# Altium schematic sheet 08 - RTD.SchDoc
size A4
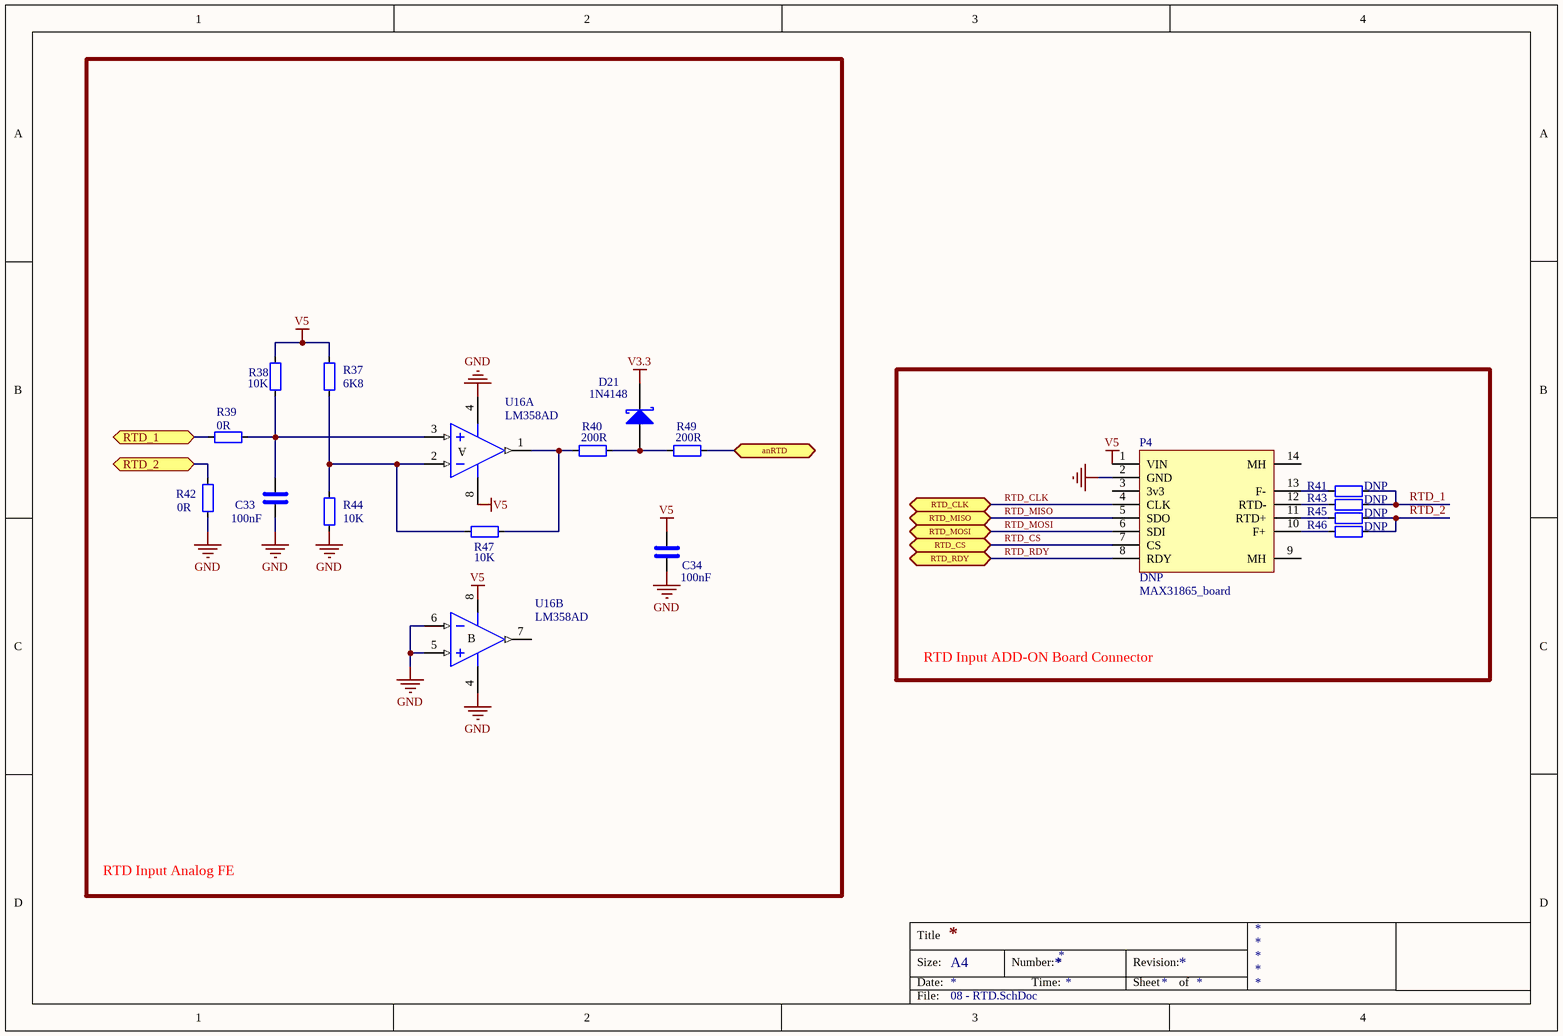
[diagram p0: 08 - RTD.SchDoc]

## Parts
C33  100nF  [CAP_0603]
C34  100nF  [CAP_0603]
D21  1N4148  [SOD323_STM_NW]
P4  DNP  value MAX31865_board  [MAX31865_board]
R37  value 6K8  [RES_0603]  (hidden comment: 60.4Ω)
R38  value 10K  [RES_0603]  (hidden comment: 10K 1%)
R39  0R  [RES_0603]
R40  value 200R  [RES_0603]  (hidden comment: 200R %5)
R41  DNP  [RES_0603]
R42  0R  [RES_0603]
R43  DNP  [RES_0603]
R44  value 10K  [RES_0603]  (hidden comment: 10K 1%)
R45  DNP  [RES_0603]
R46  DNP  [RES_0603]
R47  value 10K  [RES_0603]  (hidden comment: 10K 1%)
R49  value 200R  [RES_0603]  (hidden comment: 200R %5)
U16  LM358AD  [SO8_M]  (parts A,B of 2)

## Blocks framed on the sheet
RTD Input Analog FE: C33 C34 D21 R37-R40 R42 R44 R47 R49 U16
RTD Input ADD-ON Board Connector: P4 R41 R43 R45 R46

## Ports
anRTD (bidir), RTD_1 (bidir), RTD_2 (bidir), RTD_CLK (bidir), RTD_CS (bidir), RTD_MISO (bidir), RTD_MOSI (bidir), RTD_RDY (bidir)

## Nets
GND: C33.2 C34.2 P4.2(GND) R42.2 R44.1 U16.4(V-) U16.5(IN+) U16.6(IN-)
V3.3: D21.1(K)
V5: C34.1 P4.1(VIN) R37.1 R38.2 U16.8(V+)
anRTD: R49.2 ; port anRTD
RTD_1: R41.1 R43.1
RTD_1: R39.1 ; port RTD_1  [a separate net that carries the same name]
RTD_2: R45.1 R46.1
RTD_2: R42.1 ; port RTD_2  [a separate net that carries the same name]
RTD_CLK: P4.4(CLK) ; port RTD_CLK
RTD_CS: P4.7(CS) ; port RTD_CS
RTD_MISO: P4.5(SDO) ; port RTD_MISO
RTD_MOSI: P4.6(SDI) ; port RTD_MOSI
RTD_RDY: P4.8(RDY) ; port RTD_RDY
NetC33_1: C33.1 R38.1 R39.2 U16.3(IN+)
NetD21_2: D21.2(A) R40.2 R49.1
NetP4_10: P4.10(F+) R46.2
NetP4_11: P4.11(RTD+) R45.2
NetP4_12: P4.12(RTD-) R43.2
NetP4_13: P4.13(F-) R41.2
NetR37_2: R37.2 R44.2 R47.2 U16.2(IN-)
NetR40_1: R40.1 R47.1 U16.1(OUT)

Not connected (* = marked no-connect by the designer): P4 3(3v3) 9(MH) 14(MH); U16 7(OUT)

## Notes on the sheet
- Labels drawn without touching a wire or pin: V5
- Title
- Size:
- Date:
- A4
- Number:
- Time:
- Revision:
- Sheet
- of
- File:
- (in symbol LM358AD, part A) A
- (in symbol LM358AD, part B) B

## Library data of the parts
C33 C34 = C: pdf: https://www.lcsc.com/datasheet/lcsc_datasheet_2501031500_HRE-CGA0603X7R104K500JT_C6119867.pdf; LCSC PART: C6119867; lcsc link: https://www.lcsc.com/product-detail/Multilayer-Ceramic-Capacitors-MLCC-SMD-SMT_HRE-CGA0603X7R104K500JT_C6119867.html?s_z=n_100nF; JLCPCB: C6119867; Value: 100nF
D21 = 1N4148_KA: LCSC PART: C84063; JLCPCB: C84063; lcsc link: https://www.lcsc.com/product-detail/Switching-Diodes_Changzhou-Starsea-Elec-1N4148WS_C84063.html?s_z=n_1n4148; pdf: https://www.lcsc.com/datasheet/lcsc_datasheet_1811021610_Changzhou-Starsea-Elec-1N4148WS_C84063.pdf; Value: 1N4148
P4 = MAX31865_board: LatestRevisionDate: 17-Jul-2002; LatestRevisionNote: Re-released for DXP Platform.; Publisher: Altium Limited
R37-R47 R49 = R
  R38 R44 R47: JLCPCB: C25804; LCSC PART: C25804; lcsc link: https://www.lcsc.com/product-detail/Chip-Resistor-Surface-Mount_UNI-ROYAL-Uniroyal-Elec-0603WAF1002T5E_C25804.html
  R39 R42: Value: 0R; JLCPCB: C15402; LCSC PART: C15402; lcsc link: https://www.lcsc.com/product-detail/Chip-Resistor-Surface-Mount_UNI-ROYAL-Uniroyal-Elec-0603WAJ0000T5E_C15402.html
  R40 R49: JLCPCB: C2907123; LCSC PART: C2907123; lcsc link: https://www.lcsc.com/product-detail/Chip-Resistor-Surface-Mount_FOJAN-FRC0603J201-TS_C2907123.html
  R41 R43 R45 R46: Value: DNP
U16 = LM358AD: Low-Power Dual Operational Amplifier; Published: 24-Aug-2001; LatestRevisionDate: 13-Apr-2006; LatestRevisionNote: IPC-7351 Footprint Added.; DatasheetVersion: Jun-1998; PackageVersion: Dec-2002; PackageReference: SO8; Publisher: Altium Limited; PackageDescription: 8-Pin Small Outline Integrated Circuit 1.27 mm Pitch; Code_JEDEC: MS-012-AA; Code_IPC: SOIC127P600-8; ComponentLink1Description: Manufacturer Link; ComponentLink1URL: http://www.st.com/; ComponentLink2Description: Datasheet; ComponentLink2URL: http://www.st.com/stonline/products/literature/ds/2163/lm358.pdf; LCSC PART: C5423; lcsc link: https://www.lcsc.com/product-detail/Operational-Amplifier_Texas-Instruments-LM358DR_C5423.html?s_z=n_lm358; JLCPCB: C5423; pdf: https://www.lcsc.com/datasheet/lcsc_datasheet_1810181640_Texas-Instruments-LM358DR_C5423.pdf; Value: LM358AD